# Altium schematic sheet SPE_Phy.SchDoc
size 594 x 420 mm; SheetNumber: 4; SheetTotal: 4
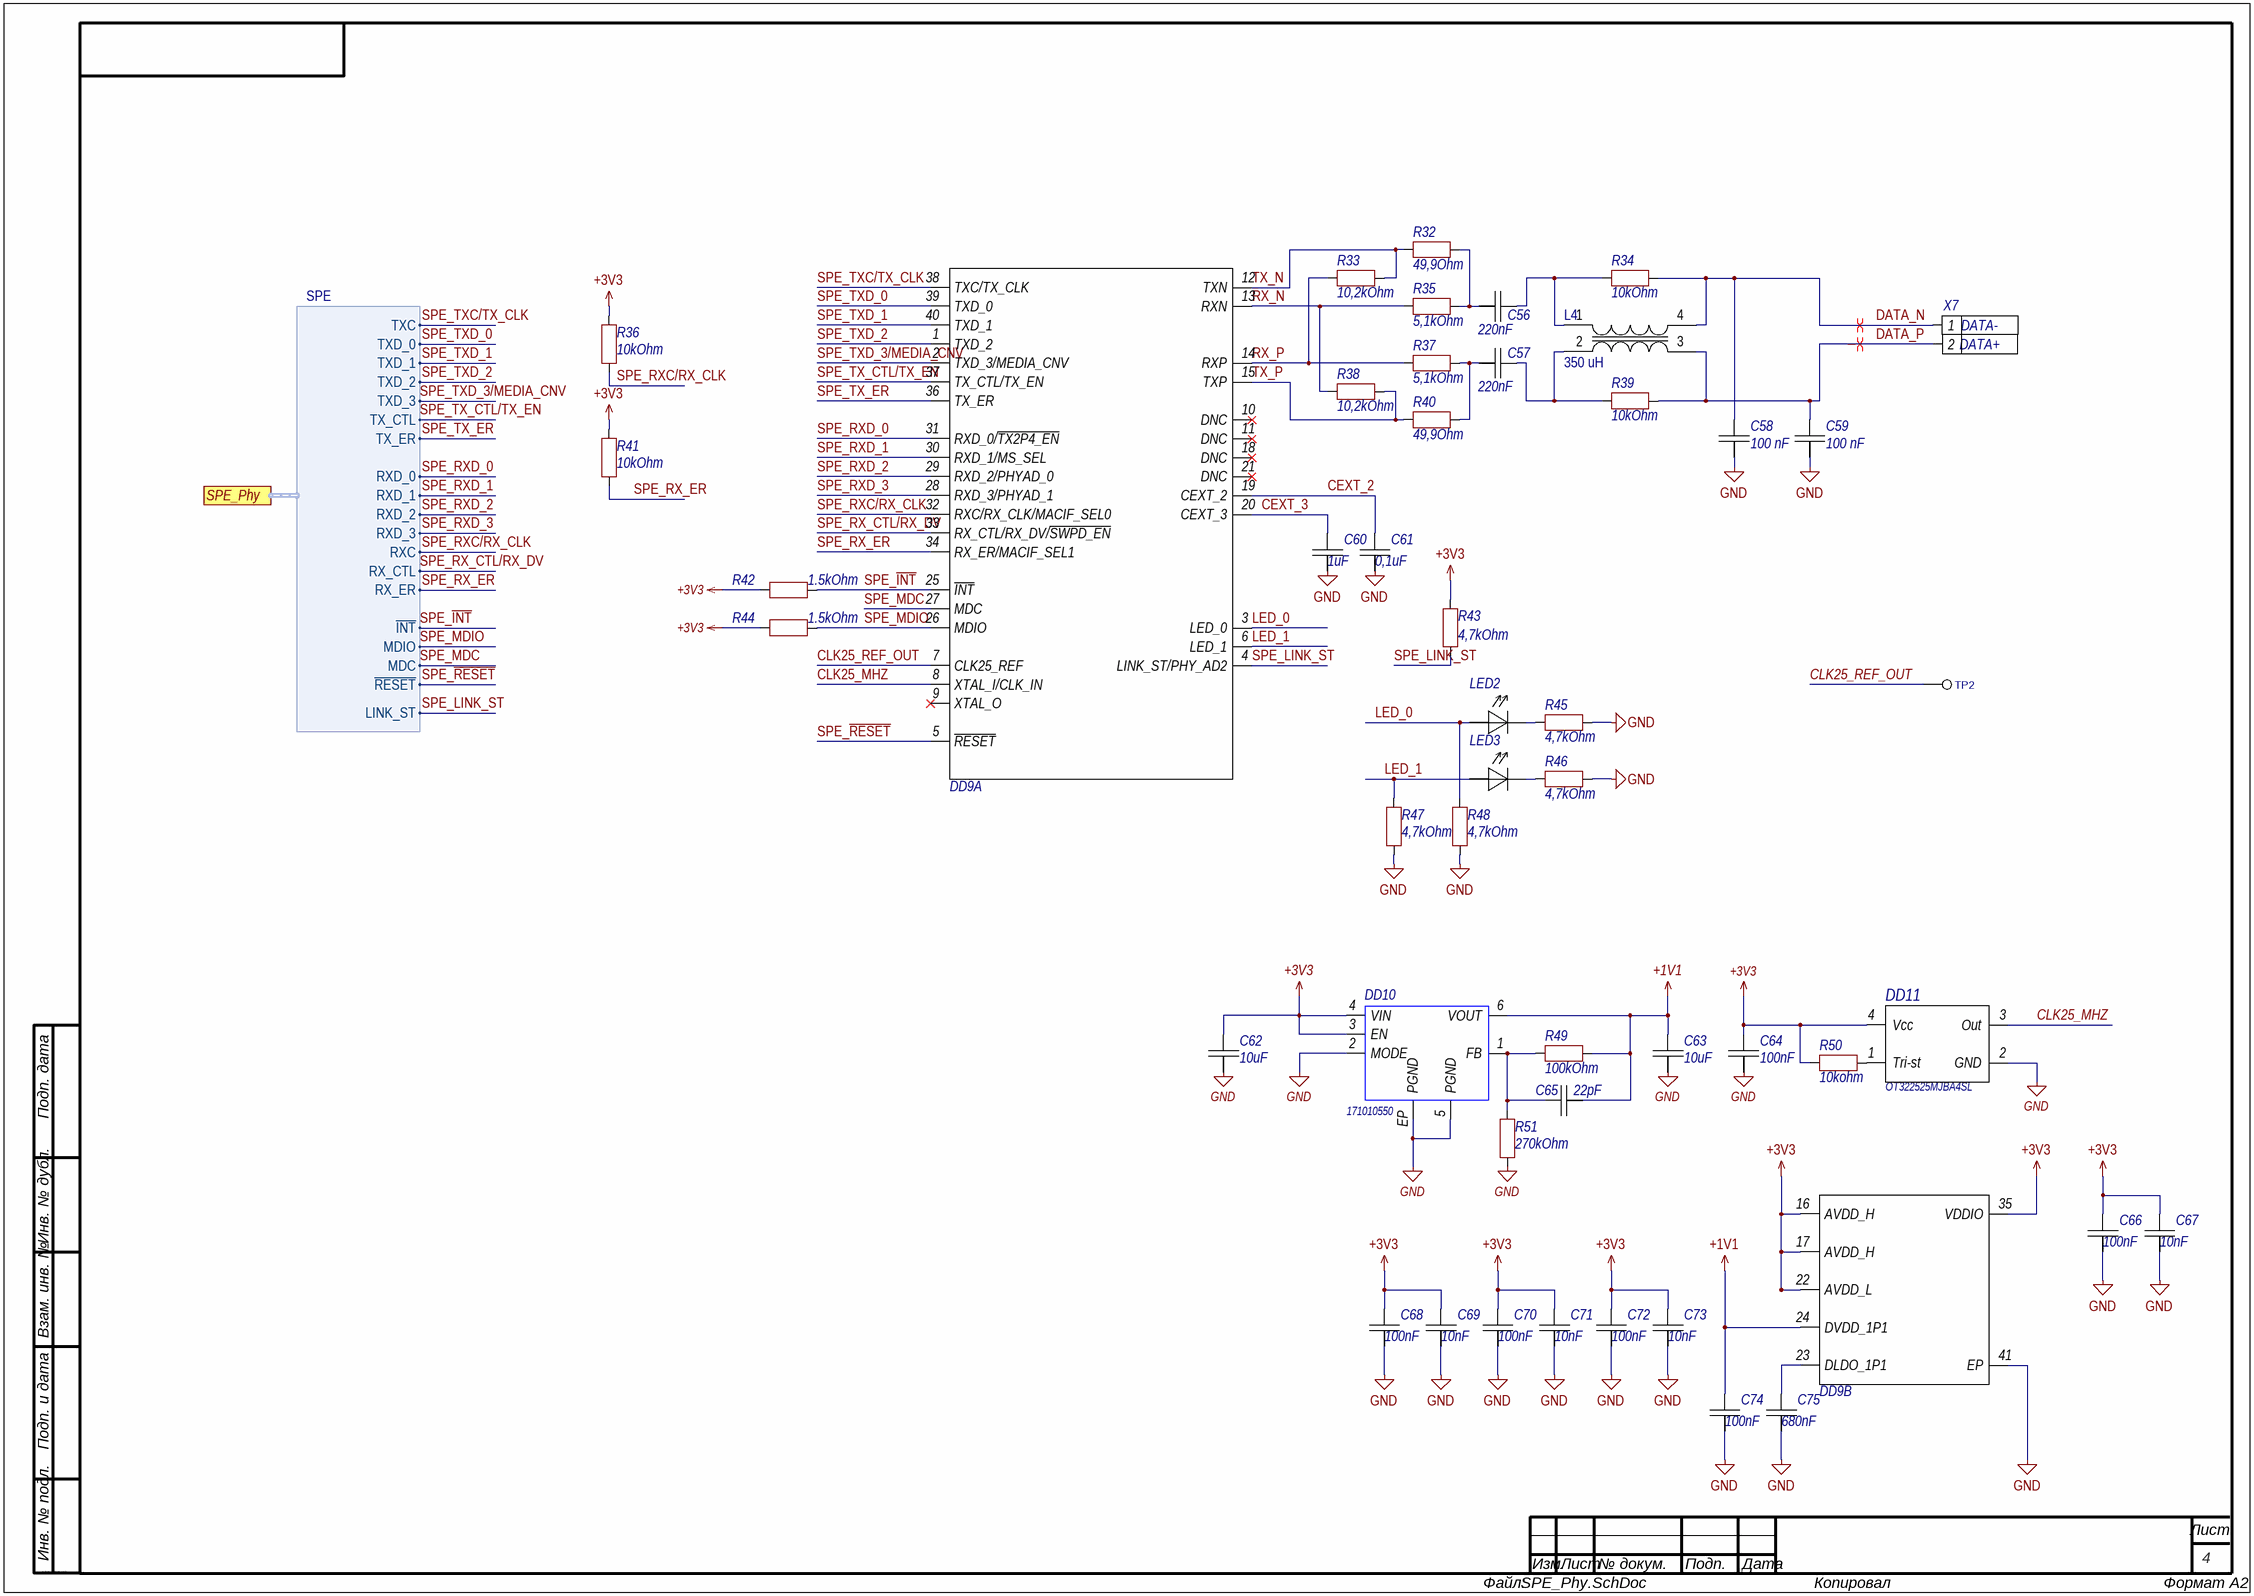
[diagram p0: SPE_Phy.SchDoc]

## Parts
C56  value 220nF  [CAP0402]  (hidden comment: 220nF *)
C57  value 220nF  [CAP0402]  (hidden comment: 220nF *)
C58  value 100 nF  [CAPC0805N]  (hidden comment: 100 nF 1kV)
C59  value 100 nF  [CAPC0805N]  (hidden comment: 100 nF 1kV)
C60  value 1uF  [CAP0402]  (hidden comment: 1uF *)
C61  value 0,1uF  [CAP0402]  (hidden comment: 0,1uF *)
C62  value 10uF  [CAPC0603N]  (hidden comment: 10uF 25V)
C63  value 10uF  [CAPC0603N]  (hidden comment: 10uF *)
C64  value 100nF  [CAP0402]  (hidden comment: 100nF *)
C65  value 22pF  [CAP0402]  (hidden comment: 22pF 50V)
C66  value 100nF  [CAP0402]  (hidden comment: 100nF *)
C67  value 10nF  [CAP0402]  (hidden comment: 10nF *)
C68  value 100nF  [CAP0402]  (hidden comment: 100nF *)
C69  value 10nF  [CAP0402]  (hidden comment: 10nF *)
C70  value 100nF  [CAP0402]  (hidden comment: 100nF *)
C71  value 10nF  [CAP0402]  (hidden comment: 10nF *)
C72  value 100nF  [CAP0402]  (hidden comment: 100nF *)
C73  value 10nF  [CAP0402]  (hidden comment: 10nF *)
C74  value 100nF  [CAP0402]  (hidden comment: 100nF *)
C75  value 680nF  [CAP0402]  (hidden comment: 680nF *)
DD9  (no value)  [LFCSP-40-01]  (parts A,B of 2)
DD10  (no value)  [171010550]
DD11  MPN: OT322525MJBA4SL  [TSX-3225_V]  (hidden comment: 25MHz)
L4  350 uH  [CHOKE_242471_WRE]
LED2  Green  [LED0805]  (value not drawn)
LED3  Green  [LED0805]  (value not drawn)
R32  49,9Ohm  [RESC0402(1005)_M]
R33  10,2kOhm  [RESC0402(1005)_M]
R34  10kOhm  [RESC0402(1005)_M]
R35  5,1kOhm  [RESC0402(1005)_M]
R36  10kOhm  [RESC0402(1005)_M]
R37  5,1kOhm  [RESC0402(1005)_M]
R38  10,2kOhm  [RESC0402(1005)_M]
R39  10kOhm  [RESC0402(1005)_M]
R40  49,9Ohm  [RESC0402(1005)_M]
R41  10kOhm  [RESC0402(1005)_M]
R42  1.5kOhm  [RESC0402(1005)_M]
R43  4,7kOhm  [RESC0805L]
R44  1.5kOhm  [RESC0402(1005)_M]
R45  4,7kOhm  [RESC0402(1005)_M]
R46  4,7kOhm  [RESC0402(1005)_M]
R47  4,7kOhm  [RESC0402(1005)_M]
R48  4,7kOhm  [RESC0402(1005)_M]
R49  100kOhm  [RESC0402(1005)_M]
R50  10kohm  [RESC0402(1005)_M]
R51  270kOhm  [RESC0402(1005)_M]
TP2  TP-SINGLE-ROUND  [TP-ROUND-TOP-1.5]  (value not drawn)  (no BOM)
X7  Wire2: DATA+  Wire1: DATA-  [X_XH-2A_2.5]  (hidden comment: XH-2A)

## Ports
SPE_Phy (harness SPE)

## Harnesses
SPE: TXC, TXD_0, TXD_1, TXD_2, TXD_3, TX_CTL, TX_ER, RXD_0, RXD_1, RXD_2, RXD_3, RXC, RX_CTL, RX_ER, ~{INT}, MDIO, MDC, ~{RESET}, LINK_ST

## Nets
+1V1: C63.2 C65.1 C74.2 DD9.24(DVDD_1P1) DD10.6(VOUT) R49.1
+3V3: C62.2 C64.2 C66.2 C67.2 C68.2 C69.2 C70.2 C71.2 C72.2 C73.2 DD9.16(AVDD_H) DD9.17(AVDD_H) DD9.22(AVDD_L) DD9.35(VDDIO) DD10.3(EN) DD10.4(VIN) DD11.4(Vcc) R36.2 R41.2 R42.1 R43.2 R44.1 R50.1
GND: C58.1 C59.1 C60.1 C61.1 C62.1 C63.1 C64.1 C66.1 C67.1 C68.1 C69.1 C70.1 C71.1 C72.1 C73.1 C74.1 C75.1 DD9.41(EP) DD10.2(MODE) DD10.5(PGND) DD10.EP(PGND) DD11.2(GND) R45.1 R46.1 R47.2 R48.2 R51.1
CEXT_2: C61.2 DD9.19(CEXT_2)
CEXT_3: C60.2 DD9.20(CEXT_3)
CLK25_MHZ: DD9.8(XTAL_I/CLK_IN) DD11.3(Out)
CLK25_REF_OUT: DD9.7(CLK25_REF) TP2.1
DATA_N: C58.2 L4.4 R34.1 X7.1
DATA_P: C59.2 L4.3 R39.1 X7.2
LED_0: DD9.3(LED_0) LED2.2(K) R48.1
LED_1: DD9.6(LED_1) LED3.2(K) R47.1
RX_N: DD9.13(RXN) R35.1 R38.1
RX_P: DD9.14(RXP) R33.1 R37.1
SPE_~{INT}: DD9.25(~{INT}) R42.2 ; port SPE_Phy.~{INT}
SPE_LINK_ST: DD9.4(LINK_ST/PHY_AD2) R43.1 ; port SPE_Phy.LINK_ST
SPE_MDC: DD9.27(MDC) ; port SPE_Phy.MDC
SPE_MDIO: DD9.26(MDIO) R44.2 ; port SPE_Phy.MDIO
SPE_~{RESET}: DD9.5(~{RESET}) ; port SPE_Phy.~{RESET}
SPE_RX_CTL/RX_DV: DD9.33(RX_CTL/RX_DV/~{SWPD_EN}) ; port SPE_Phy.RX_CTL
SPE_RX_ER: DD9.34(RX_ER/MACIF_SEL1) R41.1 ; port SPE_Phy.RX_ER
SPE_RXC/RX_CLK: DD9.32(RXC/RX_CLK/MACIF_SEL0) R36.1 ; port SPE_Phy.RXC
SPE_RXD_0: DD9.31(RXD_0/~{TX2P4_EN}) ; port SPE_Phy.RXD_0
SPE_RXD_1: DD9.30(RXD_1/MS_SEL) ; port SPE_Phy.RXD_1
SPE_RXD_2: DD9.29(RXD_2/PHYAD_0) ; port SPE_Phy.RXD_2
SPE_RXD_3: DD9.28(RXD_3/PHYAD_1) ; port SPE_Phy.RXD_3
SPE_TX_CTL/TX_EN: DD9.37(TX_CTL/TX_EN) ; port SPE_Phy.TX_CTL
SPE_TX_ER: DD9.36(TX_ER) ; port SPE_Phy.TX_ER
SPE_TXC/TX_CLK: DD9.38(TXC/TX_CLK) ; port SPE_Phy.TXC
SPE_TXD_0: DD9.39(TXD_0) ; port SPE_Phy.TXD_0
SPE_TXD_1: DD9.40(TXD_1) ; port SPE_Phy.TXD_1
SPE_TXD_2: DD9.1(TXD_2) ; port SPE_Phy.TXD_2
SPE_TXD_3/MEDIA_CNV: DD9.2(TXD_3/MEDIA_CNV) ; port SPE_Phy.TXD_3
TX_N: DD9.12(TXN) R32.1 R33.2
TX_P: DD9.15(TXP) R38.2 R40.1
NetC56_1: C56.1 R32.2 R35.2
NetC56_2: C56.2 L4.1 R34.2
NetC57_1: C57.1 R37.2 R40.2
NetC57_2: C57.2 L4.2 R39.2
NetC65_2: C65.2 DD10.1(FB) R49.2 R51.2
NetC75_2: C75.2 DD9.23(DLDO_1P1)
NetDD11_1: DD11.1(Tri-st) R50.2
NetLED2_1: LED2.1(A) R45.2
NetLED3_1: LED3.1(A) R46.2

Not connected (* = marked no-connect by the designer): DD9 9(XTAL_O)* 10(DNC)* 11(DNC)* 18(DNC)* 21(DNC)*

## Layout directives
differential pair: DATA_N, DATA_P

## Notes on the sheet
- Подп. дата
- Инв. № дубл.
- Взам. инв. №
- Подп. и дата
- Инв. № подл.
- Изм.
- Лист
- № докум.
- Подп.
- Дата
- ALTIUM GOSTBOM2.0 KEV
- Файл:
- Копировал
- Формат А2

## Library data of the parts
C56 C57 C60 C61 C64 C66-C75 = CAP0402: PartTypeRUS: пїЅпїЅпїЅпїЅпїЅпїЅпїЅпїЅпїЅпїЅпїЅ; MntType: SMD; ID: 82; MSL: MSL 1; Package: =Footprint; RoHS: Comply; PartType: CHIP CERAMIC CAPACITOR; Pins: 2; BOMDescription: =MntType+' '+PartType+' '+Package+' '+Value+' '+Tolerance+' '+Voltage+' '+TempCoeff+' '+MPN; CFootprint: =Footprint; Voltage: *; Part Number: CAP0402; BOMDescriptionRUS: пїЅпїЅпїЅпїЅпїЅпїЅпїЅпїЅпїЅпїЅпїЅ; ClassName: Capacitor; ComponentLink1Description: Datasheet
C58 C59 C62 C63 = CAPC: PartTypeRUS: пїЅпїЅпїЅпїЅпїЅпїЅпїЅпїЅпїЅпїЅпїЅ; MntType: SMD; ID: 83; MSL: MSL 1; Package: =Footprint; RoHS: Comply; PartType: CHIP CERAMIC CAPACITOR; Pins: 2; BOMDescription: =MntType+' '+PartType+' '+Package+' '+Value+' '+Tolerance+' '+Voltage+' '+TempCoeff+' '+MPN; CFootprint: =Footprint; Part Number: CAPC; BOMDescriptionRUS: пїЅпїЅпїЅпїЅпїЅпїЅпїЅпїЅпїЅпїЅпїЅ; ClassName: Capacitor; ComponentLink1Description: Datasheet
  C58 C59: Voltage: 1kV
  C62: Voltage: 25V
  C63: Voltage: *
C65 = CAP0402: MntType: SMD; MSL: MSL 1; Package: =Footprint; RoHS: Comply; PartType: CHIP CERAMIC CAPACITOR; Pins: 2; BOMDescription: =MntType+' '+PartType+' '+Package+' '+Value+' '+Tolerance+' '+Voltage+' '+TempCoeff+' '+MPN; CFootprint: =Footprint; Voltage: 50V; Part Number: CAP0402; ClassName: Capacitor; ComponentLink1Description: Datasheet
DD9 = ADIN1100BCPZ: Manufacturer: AD; PartTypeRUS: пїЅпїЅпїЅпїЅпїЅпїЅпїЅпїЅпїЅпїЅ; ID: 430; MntType: SMD; BOMDescriptionRUS: пїЅпїЅпїЅпїЅпїЅпїЅпїЅпїЅпїЅпїЅ ADIN1100BCPZ; Part Number: ADIN1100BCPZ; MPN: ADIN1100BCPZ; MSL: MSL 1; Package: =Footprint; RoHS: Comply; PartType: SPE Phy; BOMDescription: ADIN1100BCPZ; Pins: 41; CFootprint: =Footprint; ClassName: SPE Phy; ComponentLink1Description: Datasheet; ComponentLink1URL: https://www.analog.com/media/en/technical-documentation/data-sheets/adin1100.pdf
DD10 = 171010550: Manufacturer: WE; MntType: SMD; MPN: 171010550; Part Number: 171010550; MSL: MSL 1; Package: LGA-6EP; RoHS: Comply; PartType: Buck converter; Pins: 8; BOMDescription: 171010550; CFootprint: =Footprint; ClassName: Buck; ComponentLink1Description: Datasheet; ComponentLink1URL: https://www.we-online.com/catalog/datasheet/171010550_valid_from_2021-12-01.pdf
DD11 = OT322525MJBA4SL: Manufacturer: Yangxing Tech; MntType: SMD; Part Number: OT322525MJBA4SL; Value: 25MHz; MSL: MSL 1; Package: SMD3225; RoHS: Comply; PartType: Oscillator; Pins: 4; BOMDescription: OT322525MJBA4SL; CFootprint: =Footprint; ClassName: Oscillator; ComponentLink1Description: Datasheet; ComponentLink1URL: https://datasheet.lcsc.com/lcsc/2103291238_Yangxing-Tech-OT322525MJBA4SL_C669088.pdf
L4 = 744242471: SMD Common Mode Choke 350 uH
LED2 LED3 = LEDC0805: PartTypeRUS: пїЅпїЅпїЅпїЅпїЅпїЅпїЅпїЅпїЅ; MntType: SMD; ID: 197; Value: Green; MSL: MSL 5; Package: =Footprint; RoHS: Comply; PartType: CHIP LED; Pins: 2; BOMDescription: =MntType+' '+PartType+' '+Package+' '+Value+' '+Tolerance+' '+Voltage+' '+TempCoeff+' '+MPN; CFootprint: =Footprint; Part Number: LEDC0805; BOMDescriptionRUS: пїЅпїЅпїЅпїЅпїЅпїЅпїЅпїЅпїЅ; ClassName: LED; ComponentLink1Description: Datasheet
R32-R41 R45-R48 = RES0402: PartTypeRUS: пїЅпїЅпїЅпїЅпїЅпїЅпїЅпїЅ; MntType: SMD; ID: 301; MSL: MSL 1; Package: =Footprint; RoHS: Comply; PartType: CHIP RESISTOR; Pins: 2; BOMDescription: =MntType+' '+PartType+' '+Package+' '+Value+' '+Tolerance+' '+Voltage+' '+TempCoeff+' '+MPN; CFootprint: =Footprint; Part Number: RES0402; BOMDescriptionRUS: пїЅпїЅпїЅпїЅпїЅпїЅпїЅпїЅ; ClassName: Resistor; ComponentLink1Description: Datasheet
  R32 R40: Value: 49,9Ohm
  R33 R38: Value: 10,2kOhm
  R34 R36 R39 R41: Value: 10kOhm
  R35 R37: Value: 5,1kOhm
  R45-R48: Value: 4,7kOhm
R42 R44 R49-R51 = RES0402: MntType: SMD; MSL: MSL 1; Package: =Footprint; RoHS: Comply; PartType: CHIP RESISTOR; Pins: 2; BOMDescription: =MntType+' '+PartType+' '+Package+' '+Value+' '+Tolerance+' '+Voltage+' '+TempCoeff+' '+MPN; CFootprint: =Footprint; Part Number: RES0402; ClassName: Resistor; ComponentLink1Description: Datasheet
  R42 R44: Value: 1.5kOhm
  R49: Value: 100kOhm
  R50: Value: 10kohm
  R51: Value: 270kOhm
R43 = RES: PartTypeRUS: пїЅпїЅпїЅпїЅпїЅпїЅпїЅпїЅ; MntType: SMD; ID: 300; MSL: MSL 1; Package: =Footprint; RoHS: Comply; PartType: CHIP RESISTOR; Pins: 2; BOMDescription: =MntType+' '+PartType+' '+Package+' '+Value+' '+Tolerance+' '+Voltage+' '+TempCoeff+' '+MPN; CFootprint: =Footprint; Value: 4,7kOhm; Part Number: RES; BOMDescriptionRUS: пїЅпїЅпїЅпїЅпїЅпїЅпїЅпїЅ; ClassName: Resistor; ComponentLink1Description: Datasheet
TP2 = TP-SINGLE-ROUND: MntType: SMD; MSL: MSL 1; RoHS: Comply; BOMDescription: SMD; CFootprint: =Footprint; Part Number: TP-SINGLE-ROUND; ClassName: Touch; ComponentLink1Description: Datasheet
X7 = XH-2A: PartTypeRUS: пїЅпїЅпїЅпїЅпїЅпїЅ; ID: 410; MntType: DIP; BOMDescriptionRUS: пїЅпїЅпїЅпїЅпїЅпїЅ XH-2A; System: Connector; MPN: XH-2A; Part Number: XH-2A; Value: XH-2A; MSL: MSL 1; RoHS: Comply; PartType: CONNECTOR; BOMDescription: =MntType+' '+PartType+' '+Package+' '+Value+' '+Tolerance+' '+Voltage+' '+TempCoeff+' '+MPN; Pins: 2; CFootprint: =Footprint; ClassName: Connector; ComponentLink1Description: Datasheet; ComponentLink1URL: https://datasheet.lcsc.com/szlcsc/1811132110_BOOMELE-Boom-Precision-Elec-XH-2A_C20079.pdf